# Altium schematic sheet DualUSB2.0_HDR.SchDoc
size 420 x 297 mm; SheetNumber: 11; SheetTotal: 11; ModifiedBy: -; CheckedDate: -; Title2: Title 2; DivGrp: WUT ISE; Designer: G.Kasprowicz
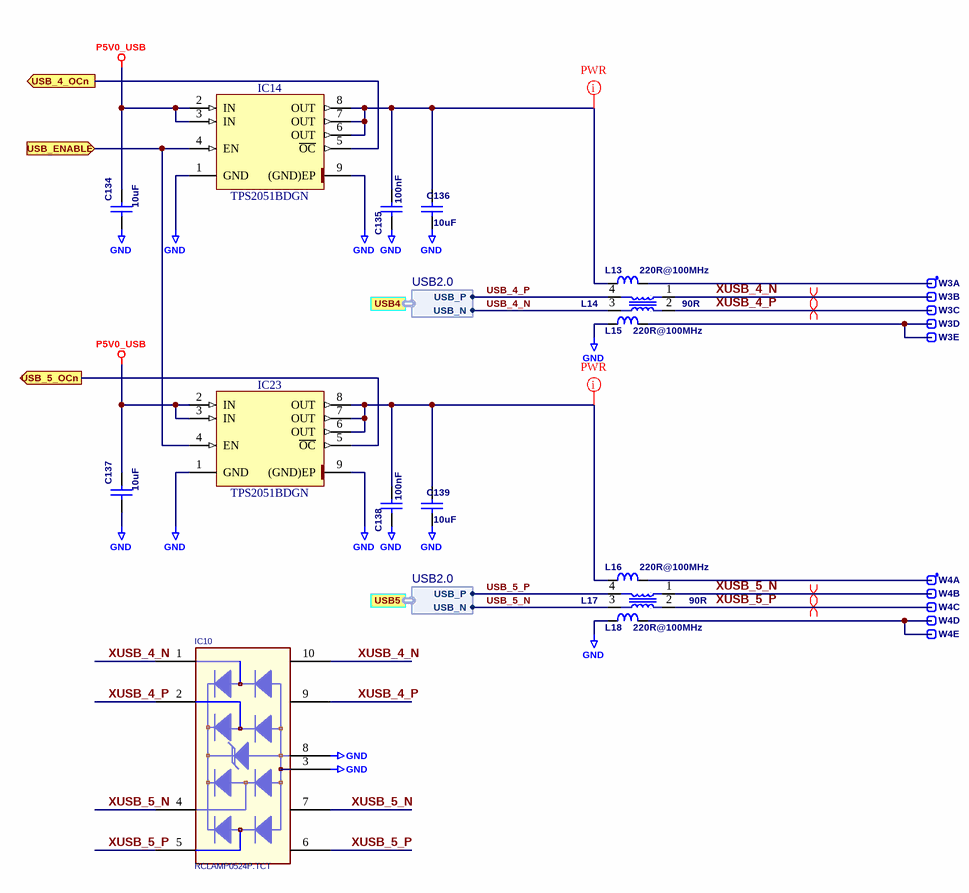
[diagram p0: DualUSB2.0_HDR.SchDoc]

## Parts
C134  10uF  [CAPC2012X135N]
C135  100nF  [CAPC1005X55N]
C136  10uF  [CAPC2012X135N]
C137  10uF  [CAPC2012X135N]
C138  100nF  [CAPC1005X55N]
C139  10uF  [CAPC2012X135N]
IC10  RCLAMP0524P.TCT  [SMDARRAYC_10P4C]
IC14  TPS2051BDGN  [SOP65P490X110-9N-R157X189]
IC23  TPS2051BDGN  [SOP65P490X110-9N-R157X189]
L13  220R@100MHz  [INDC2012X105N]
L14  value 90R  [DLSCM0805]  (hidden comment: DLSCM0805-900M or DLW21SN900SQ2L)
L15  220R@100MHz  [INDC2012X105N]
L16  220R@100MHz  [INDC2012X105N]
L17  value 90R  [DLSCM0805]  (hidden comment: DLSCM0805-900M or DLW21SN900SQ2L)
L18  220R@100MHz  [INDC2012X105N]
W3  Header 5  [SAMTEC_MTLW-105-07-L-S-250]  (value not drawn)  (parts A,B,C,D,E of 5)
W4  Header 5  [SAMTEC_MTLW-105-07-L-S-250]  (value not drawn)  (parts A,B,C,D,E of 5)

## Ports
USB4 (harness USB2.0), USB5 (harness USB2.0), USB_4_OCn (out), USB_5_OCn (out), USB_ENABLE (in)

## Harnesses
USB2.0: USB_P, USB_N

## Nets
GND: C134.1 C135.1 C136.1 C137.1 C138.1 C139.1 IC10.3 IC10.8 IC14.1(GND) IC14.9((GND)EP) IC23.1(GND) IC23.9((GND)EP) L15.1 L18.1
P5V0_USB: C134.2 C137.2 IC14.2(IN) IC14.3(IN) IC23.2(IN) IC23.3(IN)
USB_4_N: L14.3 ; port USB4.USB_N
USB_4_OCn: IC14.5(~{OC}) ; port USB_4_OCn
USB_4_P: L14.4 ; port USB4.USB_P
USB_5_N: L17.3 ; port USB5.USB_N
USB_5_OCn: IC23.5(~{OC}) ; port USB_5_OCn
USB_5_P: L17.4 ; port USB5.USB_P
USB_ENABLE: IC14.4(EN) IC23.4(EN) ; port USB_ENABLE
XUSB_4_N: IC10.1 IC10.10 L14.1 W3.2
XUSB_4_P: IC10.2 IC10.9 L14.2 W3.3
XUSB_5_N: IC10.4 IC10.7 L17.1 W4.2
XUSB_5_P: IC10.5 IC10.6 L17.2 W4.3
NetC135_2: C135.2 C136.2 IC14.6(OUT) IC14.7(OUT) IC14.8(OUT) L13.1
NetC138_2: C138.2 C139.2 IC23.6(OUT) IC23.7(OUT) IC23.8(OUT) L16.1
NetL13_2: L13.2 W3.1
NetL15_2: L15.2 W3.4 W3.5
NetL16_2: L16.2 W4.1
NetL18_2: L18.2 W4.4 W4.5

## Layout directives
differential pair: XUSB_4_N, XUSB_4_P, XUSB_5_N, XUSB_5_P
net class PWR: NetC135_2, NetC138_2

## Notes on the sheet
- Project/Equipment
- Document
- Designer
- Drawn by
- Check.by
- Copyright WUT ISE 2024.
  This documentation describes Open Hardware and is licensed under the CERN OHL v.2. You may redistribute and modify this documentation under the terms of the CERN OHL v.2. (http://ohwr.org/CERNOHL). This documentation is distributed WITHOUT ANY EXPRESS OR IMPLIED WARRANTY, INCLUDING OF MERCHANTABILITY, SATISFACTORY QUALITY AND FITNESS FOR A PARTICULAR PURPOSE. Please see the CERN OHL v.2 for applicable conditions.
- Contact
- File
- Last Mod.
- Print Date
- Sheet
- Size
- A3
- of
- Rev

## Library data of the parts
C134 C136 C137 C139 = CC0805_10UF_10V_10%_X7R: Non-polarised capacitor; Part Description: SMD Multilayer Chip Ceramic Capacitor; Manufacturer: GENERIC; Manufacturer1 Part Number: GRM21BR71A106KE51L; Voltage: 10V; TC: X7R; Tolerance: ±10%; Table: Capacitors SMD; Part Number: CC0805_10UF_10V_10%_X7R; Component Kind: Standard; Component Type: Standard; Pin Count: 2; Value: 10uF; Status: Preferred; Manufacturer Part Number: CC0805_10UF_10V_10%_X7R; Case: 0805; Mounted: Yes; Socket: No; SMD: Yes; Manufacturer1 Example: MURATA; Manufacturer1 ComponentHeight: 1.35mm; HelpURL: \\cern.ch\dfs\Applications\Altium\Datasheets\CC0805_X7R_MURATA.pdf; Author: CERN DEM JLC; CreateDate: 2012-04-30; LatestRevisionDate: 2012-04-30
C135 C138 = CC0402_100NF_16V_10%_X7R: Non-polarised capacitor; Part Description: SMD Multilayer Chip Ceramic Capacitor; Manufacturer: GENERIC; Manufacturer1 Part Number: GRM155R71C104KA88D; Voltage: 16V; TC: X7R; Tolerance: ±10%; Part Number: CC0402_100NF_16V_10%_X7R; Component Kind: Standard; Component Type: Standard; Pin Count: 2; Value: 100nF; Status: Not Recommended; Manufacturer Part Number: CC0402_100NF_16V_10%_X7R; Case: 0402; Mounted: Yes; Socket: No; SMD: Yes; Sense: No; Manufacturer1 Example: MURATA; Manufacturer1 ComponentHeight: 0.55mm; HelpURL: \\cern.ch\dfs\Applications\Altium\Datasheets\CC0402_X7R_MURATA_GRM.pdf; Author: CERN DEM JLC; CreateDate: 05/12/2013; LatestRevisionDate: 03/12/2007
IC10 = D_TVS_RCLAMP0524P: DIODE,RCLAMP0524P,SEMTECH; Specification: SMD,ESD COMPONENT,ROHS
IC14 IC23 = TPS2051BDGN: One Channel, Current-Limited, Power-Distribution Switches; Part Description: One Channel, Current-Limited (500mA), Power-Distribution Switches; Manufacturer: TEXAS INSTRUMENTS; PressFit: No; Bonding: No; Part Number: TPS2051BDGN; Component Kind: Standard; Component Type: Standard; Device: TPS2051BDGN; PackageDescription: SOP, 0.65mm Pitch; 8 Pin, 3.00mm W X 3.00mm L X 1.10mm H body (w/Thermal Tab 1.57 X 1.89mm), IPC Medium Density; Manufacturer Part Number: TPS2051BDGN; Pin Count: 8; Case: SSOP8; Mounted: Yes; Socket: No; SMD: Yes; Sense: No; ComponentHeight: 1.1mm; Author: CERN DEM BC; HelpURL: \\cern.ch\dfs\Applications\Altium\Datasheets\TPS2051BDGN.pdf; CreateDate: 06.07.2020; LatestRevisionDate: 06.07.2020
L13 L15 L16 L18 = IND0805_MURATA_BLM21PG221SN1D: Inductor; Part Description: SMD EMIFIL Suppression Chip Ferrite Bead; Manufacturer: MURATA; Power: 2A; Resistance: 0.05R; Tolerance: ±25%; Table: Inductors SMD; Part Number: IND0805_MURATA_BLM21PG221SN1D; Component Kind: Standard; Component Type: Standard; Pin Count: 2; Value: 220R@100MHz; Status: None; Manufacturer Part Number: BLM21PG221SN1D; Case: 0805; Mounted: Yes; Socket: No; SMD: Yes; ComponentHeight: 1.05mm; HelpURL: \\cern.ch\dfs\Applications\Altium\Datasheets\IND0402_MURATA_BLM21P.pdf; Author: CERN DEM JLC; CreateDate: 2010-01-25; LatestRevisionDate: 2010-01-25
L14 L17 = L_CMC_DLSCM0805_90R: Common Mode Choke 90R
W3 W4 = SAMTEC_MTLW-105-07-L-S-250: 5 Mini Wire-Wrap Contact Strip Header; Part Description: 5 Contacts, Pitch 2.54mm, Single Row Through Mount Straight Header (Post Lead = 6.35mm, Tail Lead 3.05mm, Insulator 1.52mm); Manufacturer: SAMTEC; PressFit: No; Part Number: SAMTEC_MTLW-105-07-L-S-250; Component Kind: Standard; Component Type: Standard; Pin Count: 5; Family: Header 5; Mounted: Yes; Socket: No; SMD: No; Sense: No; Status: None; Manufacturer Part Number: MTLW-105-07-L-S-250; ComponentHeight: 7.87mm; HelpURL: \\cern.ch\dfs\Applications\Altium\Datasheets\SAMTEC_MTLW-105-07-L-S-250.pdf; Author: CERN DEM JLC; CreateDate: 07.01.2015; LatestRevisionDate: 07.01.2015